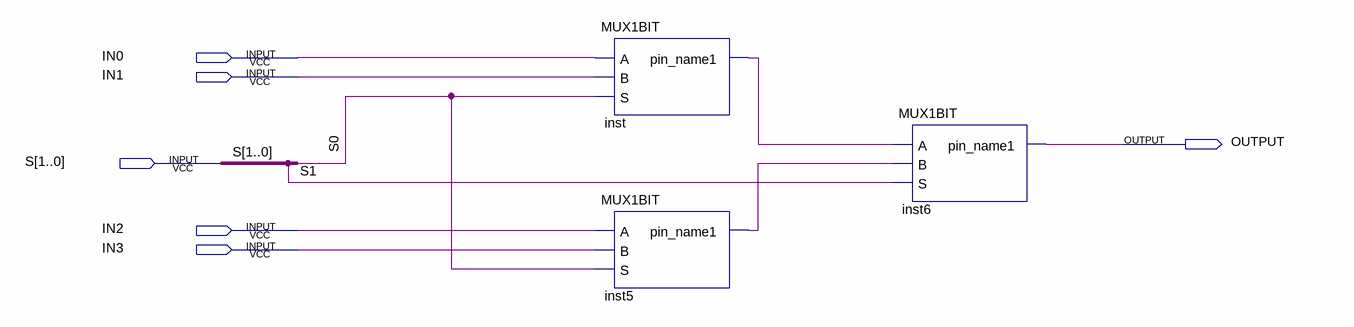
[diagram p0: schematic sheet]
// Quartus schematic MUX2BIT.bdf as structural Verilog: 3 symbols, 6 pins
module MUX2BIT (
  input  IN0,
  input  IN1,
  input  [1:0] S,
  input  IN2,
  input  IN3,
  output OUTPUT
);

  wire inst5_pin_name1, inst_pin_name1;

  MUX1BIT inst (.A(IN0), .B(IN1), .S(S[0]), .pin_name1(inst_pin_name1));
  MUX1BIT inst5 (.A(IN2), .B(IN3), .S(S[0]), .pin_name1(inst5_pin_name1));
  MUX1BIT inst6 (.A(inst_pin_name1), .B(inst5_pin_name1), .S(S[1]), .pin_name1(OUTPUT));
endmodule
